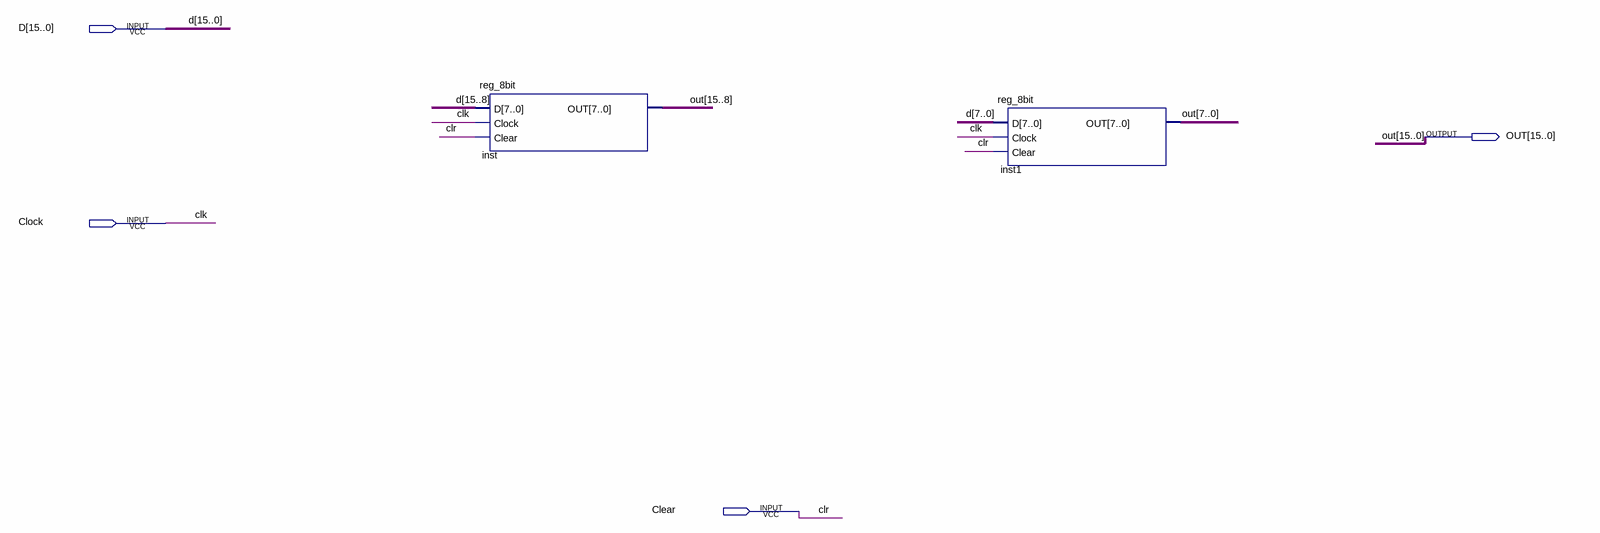
[diagram p0: schematic sheet]
// Quartus schematic reg_16bit.bdf as structural Verilog: 2 symbols, 4 pins
module reg_16bit (
  input  [15:0] D,
  input  Clock,
  input  Clear,
  output [15:0] OUT
);

  reg_8bit inst (.D(D[15:8]), .Clock(Clock), .Clear(Clear), .OUT(OUT[15:8]));
  reg_8bit inst1 (.D(D[7:0]), .Clock(Clock), .Clear(Clear), .OUT(OUT[7:0]));

  // Other names for the same wires on the sheet: clr = Clear; clk = Clock
endmodule
